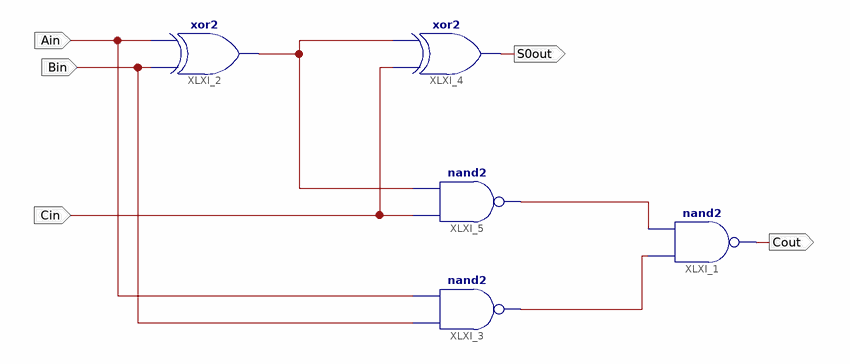
[diagram p0: schematic sheet 1]
// Xilinx ISE schematic Full_Add.sch (spartan3e) as structural Verilog: 5 symbols, 5 ports
module Full_Add (
  input  Bin,
  input  Cin,
  input  Ain,
  output S0out,
  output Cout
);

  wire XLXN_4, XLXN_6, XLXN_7;

  nand XLXI_1 (Cout, XLXN_6, XLXN_4);
  xor XLXI_2 (XLXN_7, Bin, Ain);
  nand XLXI_3 (XLXN_6, Bin, Ain);
  xor XLXI_4 (S0out, Cin, XLXN_7);
  nand XLXI_5 (XLXN_4, Cin, XLXN_7);
endmodule
